# Altium schematic sheet 1.SchDoc
size 411 x 274 mm
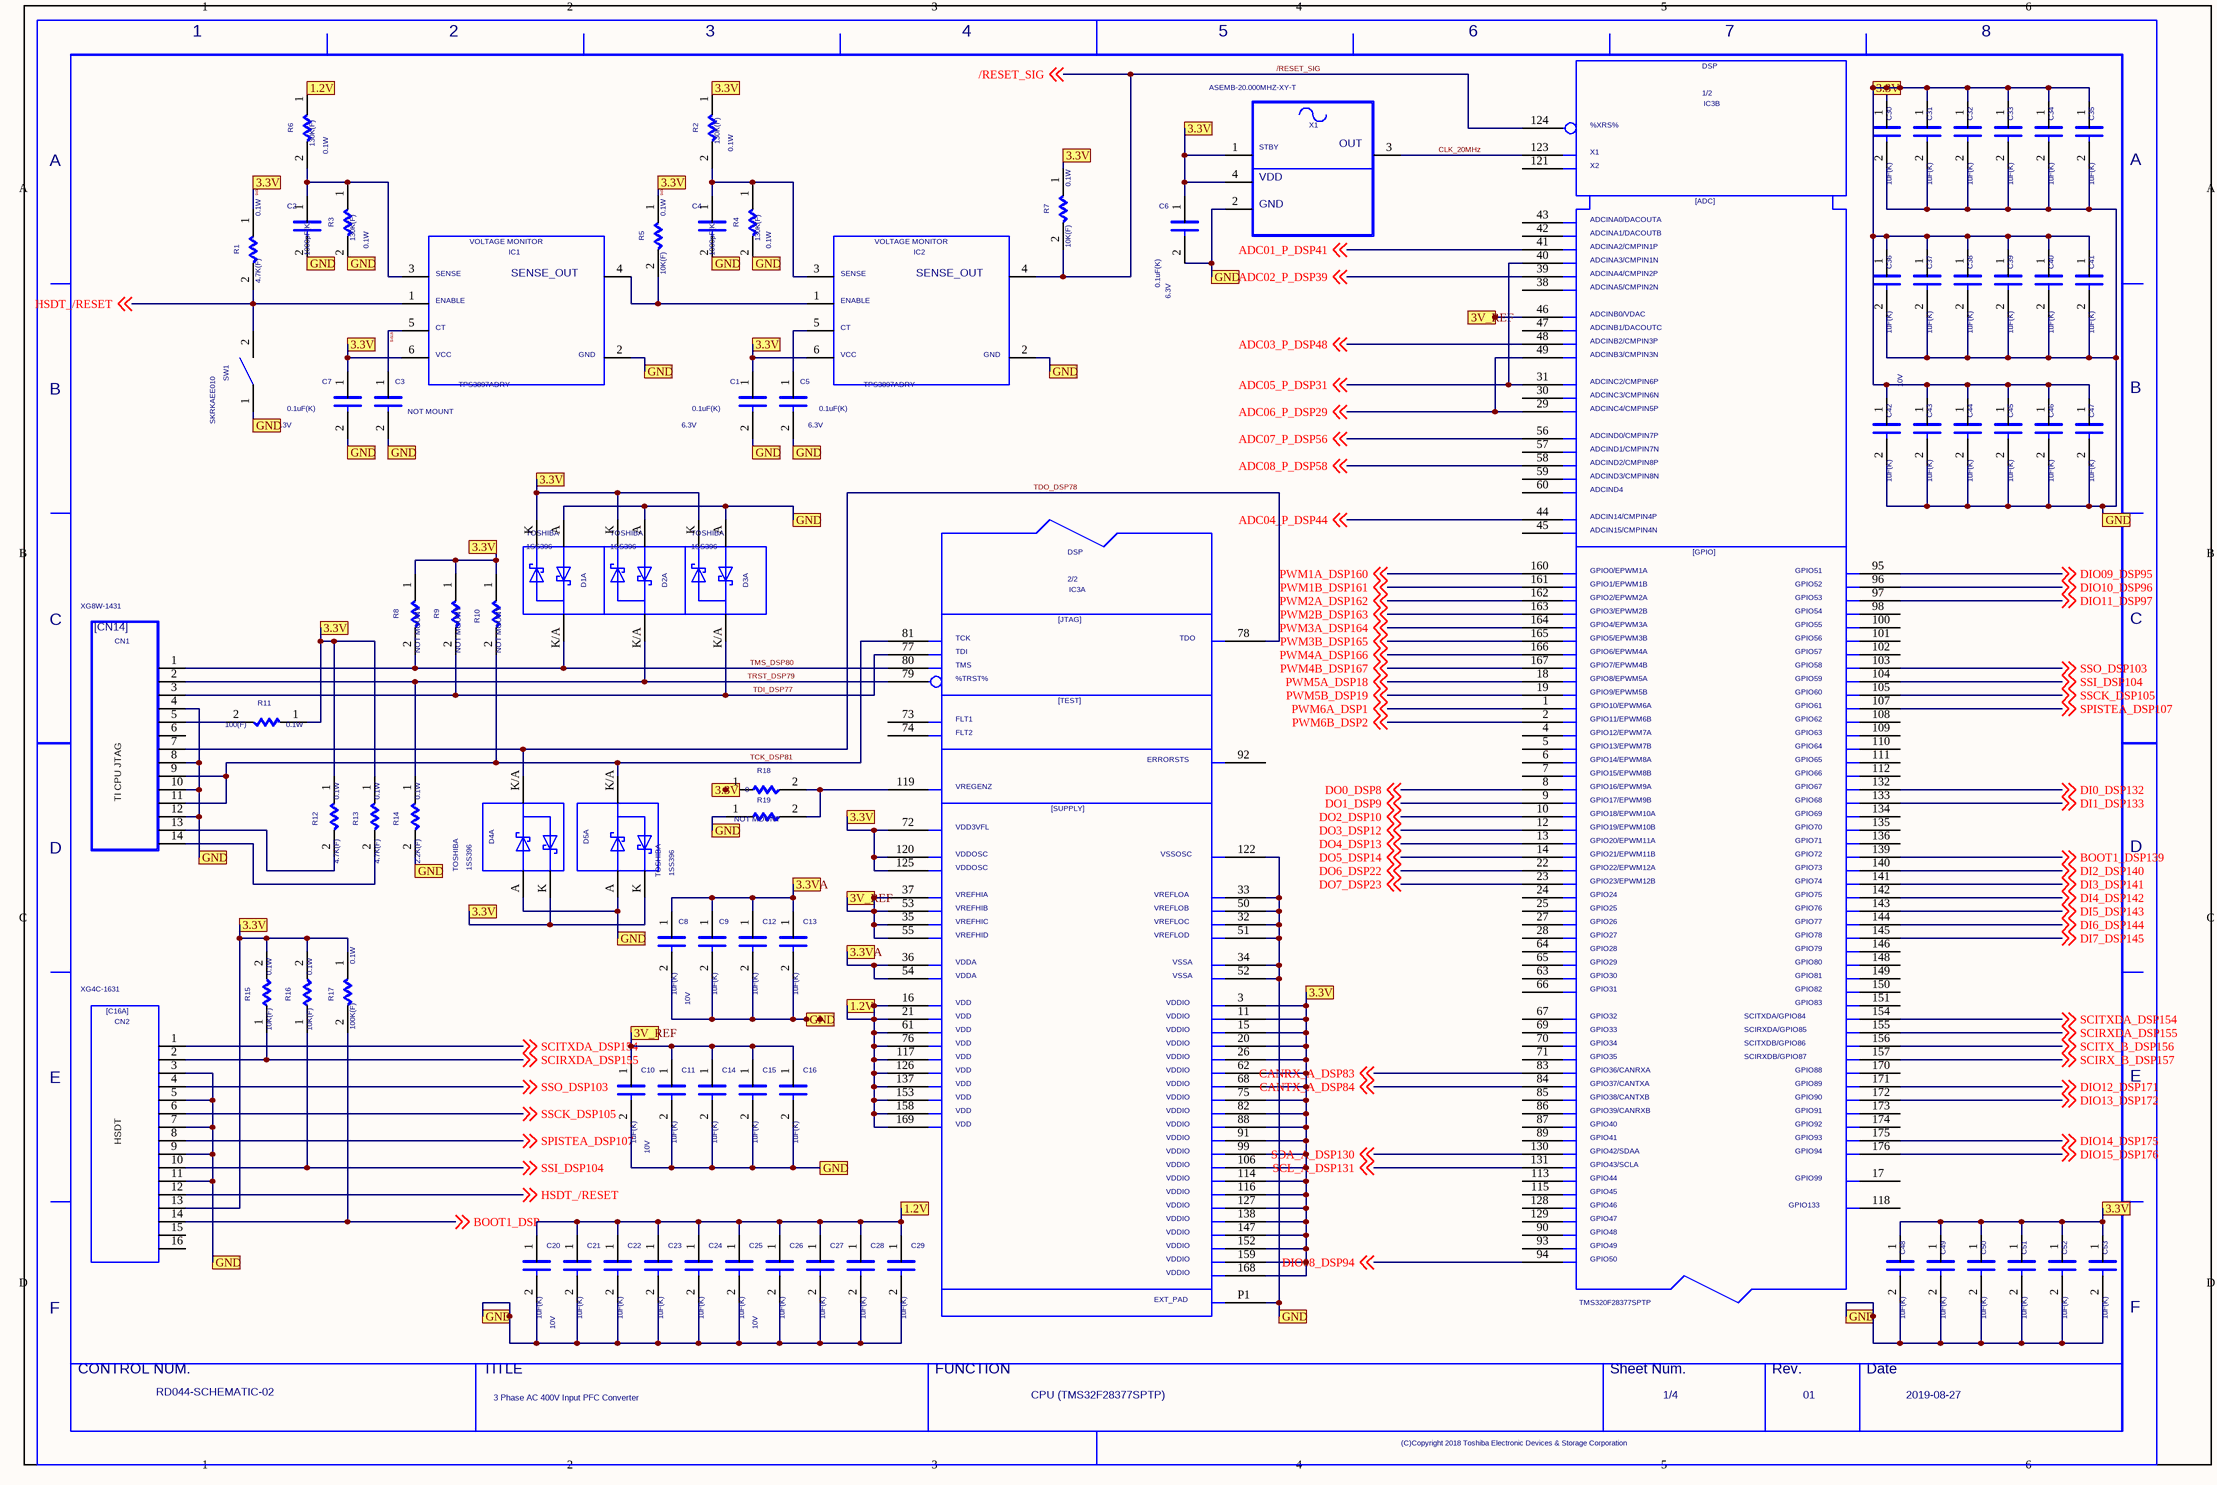
[diagram p0: 1.SchDoc]

## Parts
C1  VAL2: 6.3V  VAL1: 0.1uF(K)  (hidden comment: C)
C2  VAL2: 16V  VAL1: 1000pF(K)  (hidden comment: C)
C3  NOTMOUNT: NOT MOUNT  (hidden comment: C)
C4  VAL2: 16V  VAL1: 1000pF(K)  (hidden comment: C)
C5  VAL2: 6.3V  VAL1: 0.1uF(K)  (hidden comment: C)
C6  VAL2: 6.3V  VAL1: 0.1uF(K)  (hidden comment: C)
C7  VAL2: 6.3V  VAL1: 0.1uF(K)  (hidden comment: C)
C8  VAL2: 10V  VAL1: 1uF(K)  (hidden comment: C)
C9  VAL1: 1uF(K)  (hidden comment: C)
C10  VAL2: 10V  VAL1: 1uF(K)  (hidden comment: C)
C11  VAL1: 1uF(K)  (hidden comment: C)
C12  VAL1: 1uF(K)  (hidden comment: C)
C13  VAL1: 1uF(K)  (hidden comment: C)
C14  VAL1: 1uF(K)  (hidden comment: C)
C15  VAL1: 1uF(K)  (hidden comment: C)
C16  VAL1: 1uF(K)  (hidden comment: C)
C20  VAL2: 10V  VAL1: 1uF(K)  (hidden comment: C)
C21  VAL1: 1uF(K)  (hidden comment: C)
C22  VAL1: 1uF(K)  (hidden comment: C)
C23  VAL1: 1uF(K)  (hidden comment: C)
C24  VAL1: 1uF(K)  (hidden comment: C)
C25  VAL2: 10V  VAL1: 1uF(K)  (hidden comment: C)
C26  VAL1: 1uF(K)  (hidden comment: C)
C27  VAL1: 1uF(K)  (hidden comment: C)
C28  VAL1: 1uF(K)  (hidden comment: C)
C29  VAL1: 1uF(K)  (hidden comment: C)
C30  VAL1: 1uF(K)  (hidden comment: C)
C31  VAL1: 1uF(K)  (hidden comment: C)
C32  VAL1: 1uF(K)  (hidden comment: C)
C33  VAL1: 1uF(K)  (hidden comment: C)
C34  VAL1: 1uF(K)  (hidden comment: C)
C35  VAL1: 1uF(K)  (hidden comment: C)
C36  VAL1: 1uF(K)  (hidden comment: C)
C37  VAL1: 1uF(K)  (hidden comment: C)
C38  VAL1: 1uF(K)  (hidden comment: C)
C39  VAL1: 1uF(K)  (hidden comment: C)
C40  VAL1: 1uF(K)  (hidden comment: C)
C41  VAL1: 1uF(K)  (hidden comment: C)
C42  VAL2: 10V  VAL1: 1uF(K)  (hidden comment: C)
C43  VAL1: 1uF(K)  (hidden comment: C)
C44  VAL1: 1uF(K)  (hidden comment: C)
C45  VAL1: 1uF(K)  (hidden comment: C)
C46  VAL1: 1uF(K)  (hidden comment: C)
C47  VAL1: 1uF(K)  (hidden comment: C)
C48  VAL1: 1uF(K)  (hidden comment: C)
C49  VAL1: 1uF(K)  (hidden comment: C)
C50  VAL1: 1uF(K)  (hidden comment: C)
C51  VAL1: 1uF(K)  (hidden comment: C)
C52  VAL1: 1uF(K)  (hidden comment: C)
C53  VAL1: 1uF(K)  (hidden comment: C)
CN1  VAL3: XG8W-1431  (hidden comment: CN14)
CN2  VAL3: XG4C-1631  (hidden comment: C16A)
D1  USERCOMPTEXT3: TOSHIBA  (hidden comment: 1SS396)  (part A of 3)
D2  USERCOMPTEXT3: TOSHIBA  (hidden comment: 1SS396)  (part A of 3)
D3  USERCOMPTEXT3: TOSHIBA  (hidden comment: 1SS396)  (part A of 3)
D4  USERCOMPTEXT3: TOSHIBA  (hidden comment: 1SS396)  (part A of 3)
D5  USERCOMPTEXT3: TOSHIBA  (hidden comment: 1SS396)  (part A of 3)
IC1  VAL3: TPS3897ADRY  (hidden comment: TPS3897)
IC2  VAL3: TPS3897ADRY  (hidden comment: TPS3897)
IC3  U320F28377_1  (value not drawn)  (parts A,B of 2)
R1  VAL2: 0.1W  VAL1: 4.7K(F)  (hidden comment: R)
R2  VAL2: 0.1W  VAL1: 130K(F)  (hidden comment: R)
R3  VAL2: 0.1W  VAL1: 130K(F)  (hidden comment: R)
R4  VAL2: 0.1W  VAL1: 130K(F)  (hidden comment: R)
R5  VAL2: 0.1W  VAL1: 10K(F)  (hidden comment: R)
R6  VAL2: 0.1W  VAL1: 130K(F)  (hidden comment: R)
R7  VAL2: 0.1W  VAL1: 10K(F)  (hidden comment: R)
R8  NOTMOUNT: NOT MOUNT  (hidden comment: R)
R9  NOTMOUNT: NOT MOUNT  (hidden comment: R)
R10  NOTMOUNT: NOT MOUNT  (hidden comment: R)
R11  VAL2: 0.1W  VAL1: 100(F)  (hidden comment: R)
R12  VAL2: 0.1W  VAL1: 4.7K(F)  (hidden comment: R)
R13  VAL2: 0.1W  VAL1: 4.7K(F)  (hidden comment: R)
R14  VAL2: 0.1W  VAL1: 2.2K(F)  (hidden comment: R)
R15  VAL2: 0.1W  VAL1: 10K(F)  (hidden comment: R)
R16  VAL2: 0.1W  VAL1: 10K(F)  (hidden comment: R)
R17  VAL2: 0.1W  VAL1: 100K(F)  (hidden comment: R)
R18  VAL1: 0  (hidden comment: R)
R19  NOTMOUNT: NOT MOUNT  (hidden comment: R)
SW1  VAL3: SKRKAEE010  (hidden comment: SW)
U?  DATE: 2019-08-27  REVISION: 01  SHEETNUMBER: 1/4  FUNCTION: CPU (TMS32F28377SPTP)  TITLE: 3 Phase AC 400V Input PFC Converter  DRAWINGNUMBER: RD044-SCHEMATIC-02  (hidden comment: WAKU_DEF100_2018)
X1  VAL3: ASEMB-20.000MHZ-XY-T  (hidden comment: ASEMB)

## Ports
1.2V, 3.3V, 3.3VA, 3V_REF, GND

## Nets
1.2V: C20.1 C21.1 C22.1 C23.1 C24.1 C25.1 C26.1 C27.1 C28.1 C29.1 IC3.16 IC3.21 IC3.61 IC3.76 IC3.117 IC3.126 IC3.137 IC3.153 IC3.158 IC3.169 R6.1 ; port 1.2V
3.3VA: C8.1 C9.1 C12.1 C13.1 IC3.36 IC3.54 ; port 3.3VA
3V_REF: C10.1 C11.1 C14.1 C15.1 C16.1 IC3.35 IC3.37 IC3.46 IC3.53 IC3.55 ; port 3V_REF
/RESET_SIG: IC2.4 IC3.124 R7.2 ; off-sheet /RESET_SIG
ADC01_P_DSP41: IC3.41 ; off-sheet ADC01_P_DSP41
ADC02_P_DSP39: IC3.39 ; off-sheet ADC02_P_DSP39
ADC03_P_DSP48: IC3.48 ; off-sheet ADC03_P_DSP48
ADC04_P_DSP44: IC3.44 ; off-sheet ADC04_P_DSP44
ADC05_P_DSP31: IC3.31 IC3.40 ; off-sheet ADC05_P_DSP31
ADC06_P_DSP29: IC3.29 IC3.49 ; off-sheet ADC06_P_DSP29
ADC07_P_DSP56: IC3.56 ; off-sheet ADC07_P_DSP56
ADC08_P_DSP58: IC3.58 ; off-sheet ADC08_P_DSP58
BOOT1_DSP: CN2.14 R17.2 ; off-sheet BOOT1_DSP
BOOT1_DSP139: IC3.139 ; off-sheet BOOT1_DSP139
CANRX_A_DSP83: IC3.83 ; off-sheet CANRX_A_DSP83
CANTX_A_DSP84: IC3.84 ; off-sheet CANTX_A_DSP84
CLK_20MHz: IC3.123 X1.3
DI0_DSP132: IC3.132 ; off-sheet DI0_DSP132
DI1_DSP133: IC3.133 ; off-sheet DI1_DSP133
DI2_DSP140: IC3.140 ; off-sheet DI2_DSP140
DI3_DSP141: IC3.141 ; off-sheet DI3_DSP141
DI4_DSP142: IC3.142 ; off-sheet DI4_DSP142
DI5_DSP143: IC3.143 ; off-sheet DI5_DSP143
DI6_DSP144: IC3.144 ; off-sheet DI6_DSP144
DI7_DSP145: IC3.145 ; off-sheet DI7_DSP145
DIO08_DSP94: IC3.94 ; off-sheet DIO08_DSP94
DIO09_DSP95: IC3.95 ; off-sheet DIO09_DSP95
DIO10_DSP96: IC3.96 ; off-sheet DIO10_DSP96
DIO11_DSP97: IC3.97 ; off-sheet DIO11_DSP97
DIO12_DSP171: IC3.171 ; off-sheet DIO12_DSP171
DIO13_DSP172: IC3.172 ; off-sheet DIO13_DSP172
DIO14_DSP175: IC3.175 ; off-sheet DIO14_DSP175
DIO15_DSP176: IC3.176 ; off-sheet DIO15_DSP176
DO0_DSP8: IC3.8 ; off-sheet DO0_DSP8
DO1_DSP9: IC3.9 ; off-sheet DO1_DSP9
DO2_DSP10: IC3.10 ; off-sheet DO2_DSP10
DO3_DSP12: IC3.12 ; off-sheet DO3_DSP12
DO4_DSP13: IC3.13 ; off-sheet DO4_DSP13
DO5_DSP14: IC3.14 ; off-sheet DO5_DSP14
DO6_DSP22: IC3.22 ; off-sheet DO6_DSP22
DO7_DSP23: IC3.23 ; off-sheet DO7_DSP23
GND: C1.2 C2.2 C3.2 C4.2 C5.2 C6.2 C7.2 C8.2 C9.2 C10.2 C11.2 C12.2 C13.2 C14.2 C15.2 C16.2 C20.2 C21.2 C22.2 C23.2 C24.2 C25.2 C26.2 C27.2 C28.2 C29.2 C30.2 C31.2 C32.2 C33.2 C34.2 C35.2 C36.2 C37.2 C38.2 C39.2 C40.2 C41.2 C42.2 C43.2 C44.2 C45.2 C46.2 C47.2 C48.2 C49.2 C50.2 C51.2 C52.2 C53.2 CN1.4 CN1.8 CN1.10 CN1.12 CN2.3 CN2.5 CN2.7 CN2.9 CN2.11 D1.A D2.A D3.A D4.A D5.A IC1.2 IC2.2 IC3.32 IC3.33 IC3.34 IC3.50 IC3.51 IC3.52 IC3.122 IC3.P1 R3.2 R4.2 R14.2 R19.1 SW1.1 X1.2 ; port GND
HSDT_/RESET: CN2.12 IC1.1 R1.2 SW1.2 ; off-sheet HSDT_/RESET
N16607086: IC1.4 IC2.1 R5.2
N16607090: C4.1 IC2.3 R2.2 R4.1
N16607182: C2.1 IC1.3 R3.1 R6.2
N16607210: C5.1 IC2.5
N16608626: CN1.5 R11.2
N16609034: CN1.13 R12.2
N16609038: CN1.14 R13.2
N16609736: IC3.119 R18.2 R19.2
PWM1A_DSP160: IC3.160 ; off-sheet PWM1A_DSP160
PWM1B_DSP161: IC3.161 ; off-sheet PWM1B_DSP161
PWM2A_DSP162: IC3.162 ; off-sheet PWM2A_DSP162
PWM2B_DSP163: IC3.163 ; off-sheet PWM2B_DSP163
PWM3A_DSP164: IC3.164 ; off-sheet PWM3A_DSP164
PWM3B_DSP165: IC3.165 ; off-sheet PWM3B_DSP165
PWM4A_DSP166: IC3.166 ; off-sheet PWM4A_DSP166
PWM4B_DSP167: IC3.167 ; off-sheet PWM4B_DSP167
PWM5A_DSP18: IC3.18 ; off-sheet PWM5A_DSP18
PWM5B_DSP19: IC3.19 ; off-sheet PWM5B_DSP19
PWM6A_DSP1: IC3.1 ; off-sheet PWM6A_DSP1
PWM6B_DSP2: IC3.2 ; off-sheet PWM6B_DSP2
SCIRX_B_DSP157: IC3.157 ; off-sheet SCIRX_B_DSP157
SCIRXDA_DSP155: CN2.2 IC3.155 R15.1 ; off-sheet SCIRXDA_DSP155
SCITX_B_DSP156: IC3.156 ; off-sheet SCITX_B_DSP156
SCITXDA_DSP154: CN2.1 IC3.154 ; off-sheet SCITXDA_DSP154
SCL_A_DSP131: IC3.131 ; off-sheet SCL_A_DSP131
SDA_A_DSP130: IC3.130 ; off-sheet SDA_A_DSP130
SIG15: C3.1 IC1.5
SIG462: C1.1 C6.1 C7.1 C30.1 C31.1 C32.1 C33.1 C34.1 C35.1 C36.1 C37.1 C38.1 C39.1 C40.1 C41.1 C42.1 C43.1 C44.1 C45.1 C46.1 C47.1 C48.1 C49.1 C50.1 C51.1 C52.1 C53.1 CN2.13 D1.K D2.K D3.K D4.K D5.K IC1.6 IC2.6 IC3.3 IC3.11 IC3.15 IC3.20 IC3.26 IC3.62 IC3.68 IC3.72 IC3.75 IC3.82 IC3.88 IC3.91 IC3.99 IC3.106 IC3.114 IC3.116 IC3.120 IC3.125 IC3.127 IC3.138 IC3.147 IC3.152 IC3.159 IC3.168 R1.1 R2.1 R5.1 R7.1 R8.1 R9.1 R10.1 R11.1 R12.1 R13.1 R15.2 R16.2 R17.1 R18.1 X1.1 X1.4 ; port 3.3V  [also labelled SIG464]
SPISTEA_DSP107: CN2.8 IC3.107 ; off-sheet SPISTEA_DSP107
SSCK_DSP105: CN2.6 IC3.105 ; off-sheet SSCK_DSP105
SSI_DSP104: CN2.10 IC3.104 R16.1 ; off-sheet SSI_DSP104
SSO_DSP103: CN2.4 IC3.103 ; off-sheet SSO_DSP103
TCK_DSP81: CN1.9 CN1.11 D5.K/A IC3.81 R10.2
TDI_DSP77: CN1.3 D3.K/A IC3.77 R9.2
TDO_DSP78: CN1.7 D4.K/A IC3.78
TMS_DSP80: CN1.1 D1.K/A IC3.80 R8.2
TRST_DSP79: CN1.2 D2.K/A IC3.79 R14.1

Not connected (* = marked no-connect by the designer): CN1 6; CN2 15 16; IC3 4 5 6 7 17 24 25 27 28 30 38 42 43 45 47 57 59 60 63 64 65 66 67 69 70 71 73 74 85 86 87 89 90 92 93 98 100 101 102 108 109 110 111 112 113 115 118 121 128 129 134 135 136 146 148 149 150 151 170 173 174

## Notes on the sheet
- (near CN1) TI CPU JTAG
- (near CN2) HSDT
- (in symbol ASEMB) OUT; STBY; VDD; GND
- (in symbol C16A) [C16A]
- (in symbol CN14) [CN14]
- (in symbol TPS3897) VOLTAGE MONITOR; SENSE; SENSE_OUT; ENABLE; CT; VCC; GND
- (in symbol U320F28377_1, part A) DSP; 2/2; [JTAG]; TCK; TDO; TDI; TMS; %TRST%; [TEST]; FLT1; FLT2; ERRORSTS; VREGENZ; [SUPPLY]; VDD3VFL; VDDOSC; VSSOSC; VREFHIA; VREFLOA; VREFHIB; VREFLOB; VREFHIC; VREFLOC; VREFHID; VREFLOD; VDDA; VSSA; VDD; VDDIO; EXT_PAD
- (in symbol U320F28377_1, part B) DSP; 1/2; %XRS%; X1; X2; [ADC]; ADCINA0/DACOUTA; ADCINA1/DACOUTB; ADCINA2/CMPIN1P; ADCINA3/CMPIN1N; ADCINA4/CMPIN2P; ADCINA5/CMPIN2N; ADCINB0/VDAC; ADCINB1/DACOUTC; ADCINB2/CMPIN3P; ADCINB3/CMPIN3N; ADCINC2/CMPIN6P; ADCINC3/CMPIN6N; ADCINC4/CMPIN5P; ADCIND0/CMPIN7P; ADCIND1/CMPIN7N; ADCIND2/CMPIN8P; ADCIND3/CMPIN8N; ADCIND4; ADCIN14/CMPIN4P; ADCIN15/CMPIN4N; [GPIO]; GPIO0/EPWM1A; GPIO51; GPIO1/EPWM1B; GPIO52; GPIO2/EPWM2A; GPIO53; GPIO3/EPWM2B; GPIO54; GPIO4/EPWM3A; GPIO55; GPIO5/EPWM3B; GPIO56; GPIO6/EPWM4A; GPIO57; GPIO7/EPWM4B; GPIO58; GPIO8/EPWM5A; GPIO59; GPIO9/EPWM5B; GPIO60; GPIO10/EPWM6A; GPIO61; GPIO11/EPWM6B; GPIO62; GPIO12/EPWM7A; GPIO63; GPIO13/EPWM7B; GPIO64; GPIO14/EPWM8A; GPIO65; GPIO15/EPWM8B; GPIO66; GPIO16/EPWM9A; GPIO67; GPIO17/EPWM9B; GPIO68; GPIO18/EPWM10A; GPIO69; GPIO19/EPWM10B; GPIO70; GPIO20/EPWM11A; GPIO71; GPIO21/EPWM11B; GPIO72; GPIO22/EPWM12A; GPIO73; GPIO23/EPWM12B; GPIO74; GPIO24; GPIO75; GPIO25; GPIO76; GPIO26; GPIO77; GPIO27; GPIO78; GPIO28; GPIO79; GPIO29; GPIO80; GPIO30; GPIO81; GPIO31; GPIO82; GPIO83; GPIO32; SCITXDA/GPIO84; GPIO33; SCIRXDA/GPIO85; GPIO34; SCITXDB/GPIO86; GPIO35; SCIRXDB/GPIO87; GPIO36/CANRXA; GPIO88; GPIO37/CANTXA; GPIO89; GPIO38/CANTXB; GPIO90; GPIO39/CANRXB; GPIO91; GPIO40; GPIO92; GPIO41; GPIO93; GPIO42/SDAA; GPIO94; GPIO43/SCLA; GPIO44; GPIO99; GPIO45; GPIO46; GPIO133; GPIO47; GPIO48; GPIO49; GPIO50
- (in symbol WAKU_DEF100_2018) 1; 3; 5; 6; 7; 8; A; B; C; D; E; F; CONTROL NUM.; TITLE; FUNCTION; Sheet Num.; Rev.; Date; (C)Copyright 2018 Toshiba Electronic Devices & Storage Corporation

## Library data of the parts
C1 C5-C7 = C: PARTNAME: C-GRM155R70J104KA01D; OriginalSymbolOrigin: (2540,7620); USERCOMPTEXT1: 1005; COMPONENTTYPE: 4; COMPONENTKIND: 108
C2 C4 = C: PARTNAME: C-GRM188R71C102KA01D; OriginalSymbolOrigin: (2540,7620); USERCOMPTEXT1: 1608; COMPONENTTYPE: 4; COMPONENTKIND: 108
C3 = C: PARTNAME: C-1608_NM; OriginalSymbolOrigin: (2540,7620); USERCOMPTEXT1: 1608; COMPONENTTYPE: 4; COMPONENTKIND: 108
C8 C10 C20 C25 C42 = C: PARTNAME: C-GRM188R71A105KA61D; OriginalSymbolOrigin: (2540,7620); USERCOMPTEXT1: 1608; COMPONENTTYPE: 4; COMPONENTKIND: 108
C9 C11-C16 C21-C24 C26-C41 C43-C53 = C: PARTNAME: C-GRM188R71A105KA61D; OriginalSymbolOrigin: (2540,7620); COMPONENTTYPE: 4; COMPONENTKIND: 108
CN1 = CN14: PARTNAME: CN-XG8W-1431; OUMEPARTTYPE: CN; OriginalSymbolOrigin: (2540,45720); RATEDCURRENT: 3; MAXGCOUNT: 1; OUMEMAKER: OMR オャ鴻・; NUMBEROFCONTACT: 14; FNLEADFREETHET1GT2GMCTH1: N_N_N; OUMECLASSIFICATION: プリント板用角形コネクタ; CONTACTPITCH: 2.54m; ADSCNVFLAG: ON; COMPONENTTYPE: 4; COMPONENTKIND: 111; GCOUNT: 1; OUMEMAKERKATAMEI: XG8W-1431
CN2 = C16A: PARTNAME: CN-XG4C-1631; SAVEAREA0: -32851,-599,52300,52191; TIME: 12:01:18; UPDATEUSER: fukuda-y; UPDATETIME: 13:44:49; SAVECOUNT: 2; OriginalSymbolOrigin: (2540,48260); COMPONENTTYPE: 4; COMPONENTKIND: 135; AUTHOR: fukuda-y; DATE: 2005/02/01; UPDATEDATE: 2005/02/01
D1-D5 = 1SS396: PARTNAME: D-1SS396_AK; SAVECOUNT: 7; SAVEAREA0: -5465,-437,27678,21425; TIME: 18:51:12; UPDATEUSER: cae; UPDATETIME: 10:39:29; OriginalSymbolOrigin: (5080,17780); COMPONENTTYPE: 4; COMPONENTKIND: 103; AUTHOR: sato-yr; DATE: 2002/11/26; UPDATEDATE: 2019/08/02; VAL3: 1SS396
IC1 IC2 = TPS3897: PARTNAME: IC-TPS3897ADRY; SAVEAREA0: -10817,-344,54055,33349; TIME: 16:54:57; UPDATEUSER: cae; UPDATETIME: 13:48:08; SAVECOUNT: 66; OriginalSymbolOrigin: (5080,30480); COMPONENTTYPE: 4; COMPONENTKIND: 101; AUTHOR: iketani; DATE: 2006/02/27; UPDATEDATE: 2019/07/10
IC3 = U320F28377_1: PARTNAME: IC-TMS320F28377SPTP; SAVEAREA0: -157495,-2464,228972,238585; SAVECOUNT: 59; TIME: 10:04:23; UPDATEUSER: cae; UPDATETIME: 18:05:54; OriginalSymbolOrigin: (7620,233680); CaptureCellPackProp: U320F28377_1A; VAL3: TMS320F28377SPTP; FUNCTION: TMS320F_2_function; COMPONENTTYPE: 8; COMPONENTKIND: 101; AUTHOR: sawabe-h; DATE: 2004/02/19; UPDATEDATE: 2019/07/11
R1 R12 R13 = R: PARTNAME: R-ERJ3EKF4701V; OriginalSymbolOrigin: (5080,5080); USERCOMPTEXT1: 1608; COMPONENTTYPE: 4; COMPONENTKIND: 105
R2 = R: PARTNAME: R-ERA3AEB304V; OriginalSymbolOrigin: (5080,5080); USERCOMPTEXT1: 1608; COMPONENTTYPE: 4; COMPONENTKIND: 105
R3 R17 = R: PARTNAME: R-ERJ3EKF1003V; OriginalSymbolOrigin: (5080,5080); USERCOMPTEXT1: 1608; COMPONENTTYPE: 4; COMPONENTKIND: 105
R4 = R: PARTNAME: R-ERA3AEB563V; OriginalSymbolOrigin: (5080,5080); USERCOMPTEXT1: 1608; COMPONENTTYPE: 4; COMPONENTKIND: 105
R5 R7 R15 R16 = R: PARTNAME: R-ERJ3EKF1002V; OriginalSymbolOrigin: (5080,5080); USERCOMPTEXT1: 1608; COMPONENTTYPE: 4; COMPONENTKIND: 105
R6 = R: PARTNAME: R-ERA3AEB134V; OriginalSymbolOrigin: (5080,5080); USERCOMPTEXT1: 1608; COMPONENTTYPE: 4; COMPONENTKIND: 105
R8-R10 R19 = R: PARTNAME: R-1608_NM; OriginalSymbolOrigin: (5080,5080); USERCOMPTEXT1: 1608; COMPONENTTYPE: 4; COMPONENTKIND: 105
R11 = R: PARTNAME: R-ERJ3EKF1000V; OriginalSymbolOrigin: (5080,5080); USERCOMPTEXT1: 1608; COMPONENTTYPE: 4; COMPONENTKIND: 105
R14 = R: PARTNAME: R-ERJ3EKF2201V; OriginalSymbolOrigin: (5080,5080); USERCOMPTEXT1: 1608; COMPONENTTYPE: 4; COMPONENTKIND: 105
R18 = R: PARTNAME: R-RK73Z1JTTD; OriginalSymbolOrigin: (5080,5080); COMPONENTTYPE: 4; COMPONENTKIND: 105
SW1 = SW: PARTNAME: SW-SKRKAEE010; OUMEPARTTYPE: S; SAVEAREA0: -3361,-153,18383,13055; SAVECOUNT: 49; TIME: 15:02:55; UPDATEUSER: fukuda-y; UPDATETIME: 10:01:15; OriginalSymbolOrigin: (5080,5080); RATEDCURRENT: 50m; RATEDVOLTAGE: 12; MAXGCOUNT: 1; OUMEMAKER: ALP アルプス電気; MOUNTINGDIRECTI: VERTICAL; FNLEADFREETHET1GT2GMCTH1: 2_9_N; OUMECLASSIFICATION: プッシュボタン; MOUNTINGFORM: SMD; PMPRODUCTSTYPEG: PC1; ADSCNVFLAG: ON; CDMASTERCADCELG: OP0064; NUMBEROFPOSITIO: 2; COMPONENTTYPE: 4; COMPONENTKIND: 115; AUTHOR: fukuda-y; DATE: 2001/10/19; UPDATEDATE: 2006/10/04; GCOUNT: 1; OUMEMAKERKATAMEI: SKRKAEE010
U? = WAKU_DEF100_2018: PLOTTIME: HH:MM; SAVEAREA0: -45080,-4508,463680,304612; TIME: 13:54:34; UPDATEUSER: t5459927; UPDATETIME: 12:04:35; SAVECOUNT: 4; OriginalSymbolOrigin: (10160,284480); COMPONENTTYPE: 2; COMPONENTKIND: 0; PLOTDATE: YYYY.MM.DD; AUTHOR: cae; UPDATEDATE: 2019/08/29
X1 = ASEMB: PARTNAME: X-ASEMB-20.000MHZ-XY-T; SAVEAREA0: -13388,-318,46493,30783; TIME: 14:56:21; UPDATEUSER: cae; UPDATETIME: 14:57:23; SAVECOUNT: 2; OriginalSymbolOrigin: (5080,27940); COMPONENTTYPE: 4; COMPONENTKIND: 118; AUTHOR: cae; DATE: 2019/07/10; UPDATEDATE: 2019/07/10